# EAGLE design 3MB RAM Expansion (EAGLE 4.16)
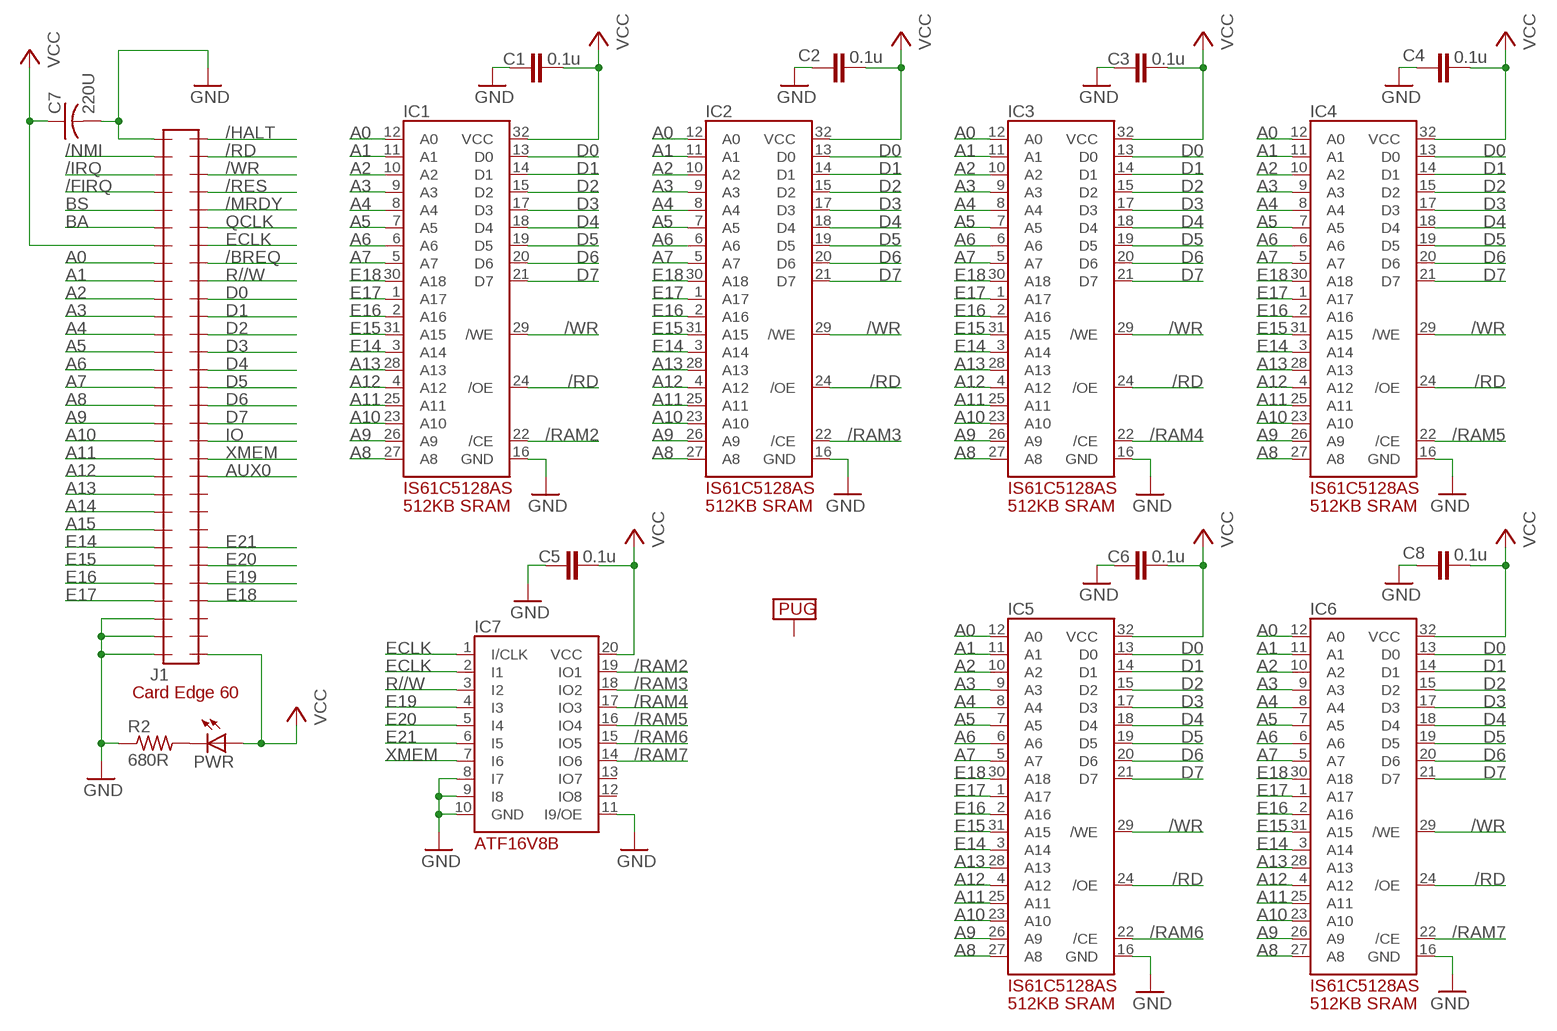
[diagram p0: schematic, sheet 1]

## Parts
C1  0.1u  C-EUC0603  [C0603]
C2  0.1u  C-EUC0603  [C0603]
C3  0.1u  C-EUC0603  [C0603]
C4  0.1u  C-EUC0603  [C0603]
C5  0.1u  C-EUC0603  [C0603]
C6  0.1u  C-EUC0603  [C0603]
C7  220U  C-US025-050X050  [C025-050X050]
C8  0.1u  C-EUC0603  [C0603]
IC1  IS61C5128AS  [SOIC32_11.3MM_WID]
IC2  IS61C5128AS  [SOIC32_11.3MM_WID]
IC3  IS61C5128AS  [SOIC32_11.3MM_WID]
IC4  IS61C5128AS  [SOIC32_11.3MM_WID]
IC5  IS61C5128AS  [SOIC32_11.3MM_WID]
IC6  IS61C5128AS  [SOIC32_11.3MM_WID]
IC7  PLD_ATF16V8B  [DIL20]
J1  CARDEDGE_2.54_60POS  CARDEDGE_2.54_60POSEDGE  [CARDEDGE_2.54_60POS]
PWR  LED3MM  [LED3MM]
R2  680R  R-US_R0603  [R0603]
U$1  PUG  [LARGE_PUG]

## Nets
/BREQ: J1.53
/FIRQ: J1.4
/HALT: J1.60
/IRQ: J1.3
/MRDY: J1.56
/NMI: J1.2
/RAM2: IC1.22(/CE) IC7.19(IO1)
/RAM3: IC2.22(/CE) IC7.18(IO2)
/RAM4: IC3.22(/CE) IC7.17(IO3)
/RAM5: IC4.22(/CE) IC7.16(IO4)
/RAM6: IC5.22(/CE) IC7.15(IO5)
/RAM7: IC6.22(/CE) IC7.14(IO6)
/RD: IC1.24(/OE) IC2.24(/OE) IC3.24(/OE) IC4.24(/OE) IC5.24(/OE) IC6.24(/OE) J1.59
/RES: J1.57
/WR: IC1.29(/WE) IC2.29(/WE) IC3.29(/WE) IC4.29(/WE) IC5.29(/WE) IC6.29(/WE) J1.58
A0: IC1.12(A0) IC2.12(A0) IC3.12(A0) IC4.12(A0) IC5.12(A0) IC6.12(A0) J1.8
A1: IC1.11(A1) IC2.11(A1) IC3.11(A1) IC4.11(A1) IC5.11(A1) IC6.11(A1) J1.9
A2: IC1.10(A2) IC2.10(A2) IC3.10(A2) IC4.10(A2) IC5.10(A2) IC6.10(A2) J1.10
A3: IC1.9(A3) IC2.9(A3) IC3.9(A3) IC4.9(A3) IC5.9(A3) IC6.9(A3) J1.11
A4: IC1.8(A4) IC2.8(A4) IC3.8(A4) IC4.8(A4) IC5.8(A4) IC6.8(A4) J1.12
A5: IC1.7(A5) IC2.7(A5) IC3.7(A5) IC4.7(A5) IC5.7(A5) IC6.7(A5) J1.13
A6: IC1.6(A6) IC2.6(A6) IC3.6(A6) IC4.6(A6) IC5.6(A6) IC6.6(A6) J1.14
A7: IC1.5(A7) IC2.5(A7) IC3.5(A7) IC4.5(A7) IC5.5(A7) IC6.5(A7) J1.15
A8: IC1.27(A8) IC2.27(A8) IC3.27(A8) IC4.27(A8) IC5.27(A8) IC6.27(A8) J1.16
A9: IC1.26(A9) IC2.26(A9) IC3.26(A9) IC4.26(A9) IC5.26(A9) IC6.26(A9) J1.17
A10: IC1.23(A10) IC2.23(A10) IC3.23(A10) IC4.23(A10) IC5.23(A10) IC6.23(A10) J1.18
A11: IC1.25(A11) IC2.25(A11) IC3.25(A11) IC4.25(A11) IC5.25(A11) IC6.25(A11) J1.19
A12: IC1.4(A12) IC2.4(A12) IC3.4(A12) IC4.4(A12) IC5.4(A12) IC6.4(A12) J1.20
A13: IC1.28(A13) IC2.28(A13) IC3.28(A13) IC4.28(A13) IC5.28(A13) IC6.28(A13) J1.21
A14: J1.22
A15: J1.23
AUX0: J1.41
BA: J1.6
BS: J1.5
D0: IC1.13(D0) IC2.13(D0) IC3.13(D0) IC4.13(D0) IC5.13(D0) IC6.13(D0) J1.51
D1: IC1.14(D1) IC2.14(D1) IC3.14(D1) IC4.14(D1) IC5.14(D1) IC6.14(D1) J1.50
D2: IC1.15(D2) IC2.15(D2) IC3.15(D2) IC4.15(D2) IC5.15(D2) IC6.15(D2) J1.49
D3: IC1.17(D3) IC2.17(D3) IC3.17(D3) IC4.17(D3) IC5.17(D3) IC6.17(D3) J1.48
D4: IC1.18(D4) IC2.18(D4) IC3.18(D4) IC4.18(D4) IC5.18(D4) IC6.18(D4) J1.47
D5: IC1.19(D5) IC2.19(D5) IC3.19(D5) IC4.19(D5) IC5.19(D5) IC6.19(D5) J1.46
D6: IC1.20(D6) IC2.20(D6) IC3.20(D6) IC4.20(D6) IC5.20(D6) IC6.20(D6) J1.45
D7: IC1.21(D7) IC2.21(D7) IC3.21(D7) IC4.21(D7) IC5.21(D7) IC6.21(D7) J1.44
E14: IC1.3(A14) IC2.3(A14) IC3.3(A14) IC4.3(A14) IC5.3(A14) IC6.3(A14) J1.24
E15: IC1.31(A15) IC2.31(A15) IC3.31(A15) IC4.31(A15) IC5.31(A15) IC6.31(A15) J1.25
E16: IC1.2(A16) IC2.2(A16) IC3.2(A16) IC4.2(A16) IC5.2(A16) IC6.2(A16) J1.26
E17: IC1.1(A17) IC2.1(A17) IC3.1(A17) IC4.1(A17) IC5.1(A17) IC6.1(A17) J1.27
E18: IC1.30(A18) IC2.30(A18) IC3.30(A18) IC4.30(A18) IC5.30(A18) IC6.30(A18) J1.34
E19: IC7.4(I3) J1.35
E20: IC7.5(I4) J1.36
E21: IC7.6(I5) J1.37
ECLK: IC7.1(I/CLK) IC7.2(I1) J1.54
GND [supply]: C1.1 C2.1 C3.1 C4.1 C5.1 C6.1 C7.2 C8.1 IC1.16(GND) IC2.16(GND) IC3.16(GND) IC4.16(GND) IC5.16(GND) IC6.16(GND) IC7.8(I7) IC7.9(I8) IC7.10(GND) IC7.11(I9/OE) J1.1 J1.28 J1.29 J1.30 R2.1
IO: J1.43
N$2: PWR.K(C) R2.2
QCLK: J1.55
R//W: IC7.3(I2) J1.52
VCC [supply]: C1.2 C2.2 C3.2 C4.2 C5.2 C6.2 C7.1 C8.2 IC1.32(VCC) IC2.32(VCC) IC3.32(VCC) IC4.32(VCC) IC5.32(VCC) IC6.32(VCC) IC7.20(VCC) J1.7 J1.31 PWR.A
XMEM: IC7.7(I6) J1.42
Unconnected: IC7.12(IO8) IC7.13(IO7) J1.32 J1.33 J1.38 J1.39 J1.40 U$1.P$1

## Notes on the sheet
- 512KB SRAM | 512KB SRAM | 512KB SRAM | 512KB SRAM
- 512KB SRAM | 512KB SRAM

## Library data of the parts
C1-C6 C8 = rcl:C-EU: CAPACITOR, European symbol
C7 = rcl:C-US: CAPACITOR, American symbol
IC1-IC6 = 07-Retrocomputing:IS61C5128AS
IC7 = 07-Retrocomputing:PLD_ATF16V8B
J1 = 07-Retrocomputing:CARDEDGE_2.54_60POS
PWR = led:LED: LED OSRAM: - CHIPLED LG R971, LG N971, LY N971, LG Q971, LY Q971, LO R971, LY R971 LH N974, LH R974 LS Q976, LO Q976, LY Q976 LO Q996 - Hyper CHIPLED LW Q18S LB Q993, LB Q99A, LB R99A - SideLED LS A670, LO A670, LY A670, LG A670, LP A670 LB A673, LV A673, LT A673, LW A673 LH A674 LY A675 LS A676, LA A676, LO A676, LY A676, LW A676 LS A679, LY A679, LG A679 - Hyper Micro SIDELED® LS Y876, LA Y876, LO Y876, LY Y876 LT Y87S - SmartLED LW L88C, LW L88S LB L89C, LB L89S, LG L890 LS L89K, LO L89K, LY L89K LS L896, LA L896, LO L896, LY L896 - TOPLED LS T670, LO T670, LY T670, LG T670, LP T670 LSG T670, LSP T670, LSY T670, LOP T670, LYG T670 LG T671, LOG T671, LSG T671 LB T673, LV T673, LT T673, LW T673 LH T674 LS T676, LA T676, LO T676, LY T676, LB T676, LH T676, LSB T676, LW T676 LB T67C, LV T67C, LT T67C, LS T67K, LO T67K, LY T67K, LW E67C LS E67B, LA E67B, LO E67B, LY E67B, LB E67C, LV E67C, LT E67C LW T67C LS T679, LY T679, LG T679 LS T770, LO T770, LY T770, LG T770, LP T770 LB T773, LV T773, LT T773, LW T773 LH T774 LS E675, LA E675, LY E675, LS T675 LS T776, LA T776, LO T776, LY T776, LB T776 LHGB T686 LT T68C, LB T68C - Hyper Mini TOPLED® LB M676 - Mini TOPLED Santana® LG M470 LS M47K, LO M47K, LY M47K Source: http://www.osram.convergy.de - LUMILED® LXK2-PW12-R00, LXK2-PW12-S00, LXK2-PW14-U00, LXK2-PW14-V00 LXK2-PM12-R00, LXK2-PM12-S00, LXK2-PM14-U00 LXK2-PE12-Q00, LXK2-PE12-R00, LXK2-PE12-S00, LXK2-PE14-T00, LXK2-PE14-U00 LXK2-PB12-K00, LXK2-PB12-L00, LXK2-PB12-M00, LXK2-PB14-N00, LXK2-PB14-P00, LXK2-PB14-Q00 LXK2-PR12-L00, LXK2-PR12-M00, LXK2-PR14-Q00, LXK2-PR14-R00 LXK2-PD12-Q00, LXK2-PD12-R00, LXK2-PD12-S00 LXK2-PH12-R00, LXK2-PH12-S00 LXK2-PL12-P00, LXK2-PL12-Q00, LXK2-PL12-R00 Source: www.luxeon.com
R2 = rcl:R-US_: RESISTOR, American symbol
U$1 = 07-Retrocomputing:PUG

## Net classes
0 default: width 0.203 mm, drill 0.203 mm, clearance 0.254 mm
1 supply: width 0.61 mm, drill 0.203 mm, clearance 0.305 mm

## Board
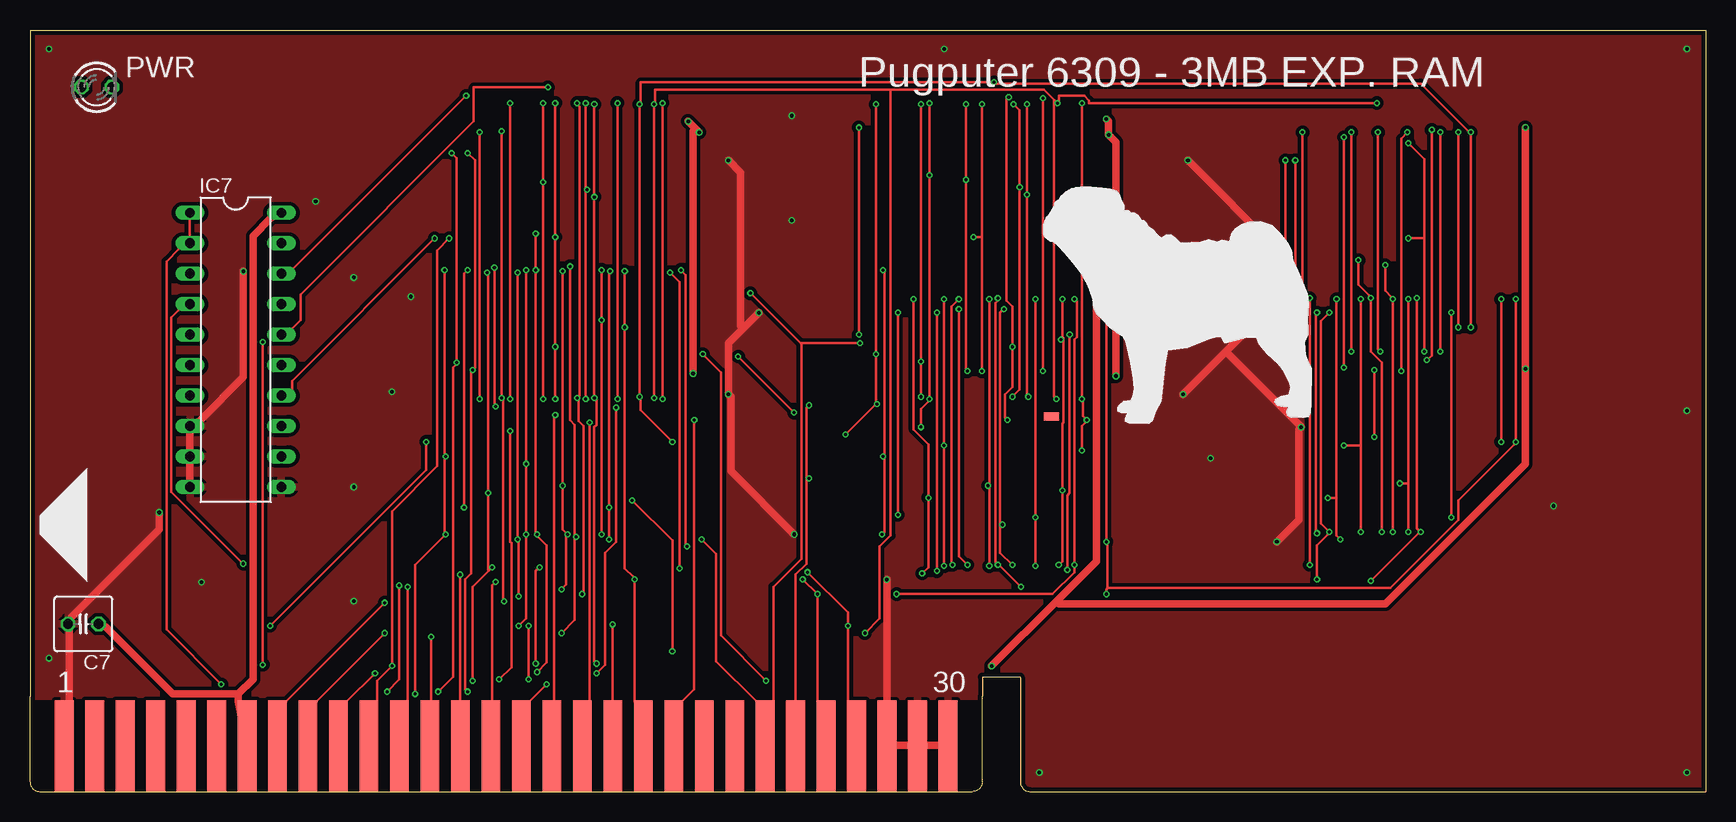
[diagram p1: board, top side]
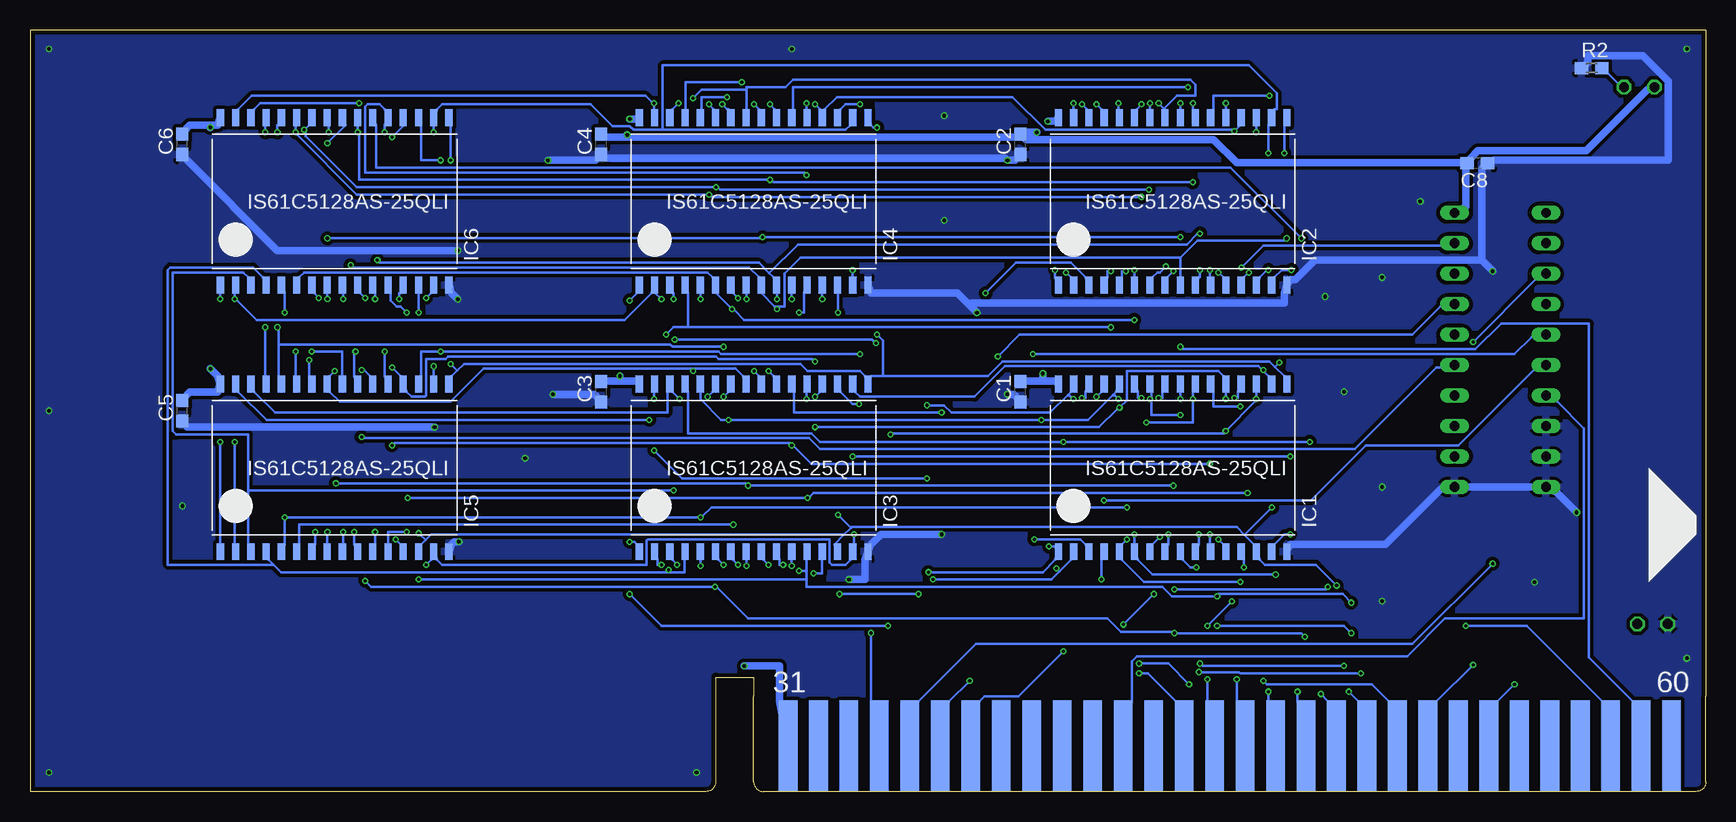
[diagram p2: board, bottom side, seen from below]

Size 139.7 x 63.5 mm. Coordinates in mm from the lower left corner, seen from the top.
Outline: 0,7.94 0,63.5 139.7,63.5 139.7,0 83.34,0 arc-90 82.55,0.79 82.55,9.53 79.38,9.53 79.38,7.94
Copper layers (1*16): Top 0.0356mm / dielectric 1.6mm / Bottom 0.0356mm
Design rules "oshpark-2layer": minimum track width 6mil, minimum drill 10mil, track to track 6mil, track to pad 6mil, pad to pad 6mil, via to via 6mil, smd to smd 6mil, copper to edge 15mil, drill to drill 6mil, minimum pad ring 5mil, minimum via ring 5mil, stop-mask expansion 2.5mil, vias tented up to drill 0mil, thermal gap 10mil

### Footprints (pad centres in the part's own frame; a part is rotated, then mirrored left to right if it is on the bottom)
C0603 = smd 1.1 x 1: 1 -0.85,0; 2 0.85,0
C025-050X050 = drill 0.813 octagon: 1 -1.27,0; 2 1.27,0
SOIC32_11.3MM_WID = smd 1.4 x 0.6: 1 -6.985,9.525; 2 -6.985,8.255; 3 -6.985,6.985; 4 -6.985,5.715; 5 -6.985,4.445; 6 -6.985,3.175; 7 -6.985,1.905; 8 -6.985,0.635; 9 -6.985,-0.635; 10 -6.985,-1.905; 11 -6.985,-3.175; 12 -6.985,-4.445; 13 -6.985,-5.715; 14 -6.985,-6.985; 15 -6.985,-8.255; 16 -6.985,-9.525; 17 6.985,-9.525; 18 6.985,-8.255; 19 6.985,-6.985; 20 6.985,-5.715; 21 6.985,-4.445; 22 6.985,-3.175; 23 6.985,-1.905; 24 6.985,-0.635; 25 6.985,0.635; 26 6.985,1.905; 27 6.985,3.175; 28 6.985,4.445; 29 6.985,5.715; 30 6.985,6.985; 31 6.985,8.255; 32 6.985,9.525
DIL20 = drill 0.813 long: 1 -11.43,-3.81; 2 -8.89,-3.81; 3 -6.35,-3.81; 4 -3.81,-3.81; 5 -1.27,-3.81; 6 1.27,-3.81; 7 3.81,-3.81; 8 6.35,-3.81; 9 8.89,-3.81; 10 11.43,-3.81; 11 11.43,3.81; 12 8.89,3.81; 13 6.35,3.81; 14 3.81,3.81; 15 1.27,3.81; 16 -1.27,3.81; 17 -3.81,3.81; 18 -6.35,3.81; 19 -8.89,3.81; 20 -11.43,3.81
CARDEDGE_2.54_60POS = smd 1.556 x 7.62: 1 -36.83,3.81; 2 -34.29,3.81; 3 -31.75,3.81; 4 -29.21,3.81; 5 -26.67,3.81; 6 -24.13,3.81; 7 -21.59,3.81; 8 -19.05,3.81; 9 -16.51,3.81; 10 -13.97,3.81; 11 -11.43,3.81; 12 -8.89,3.81; 13 -6.35,3.81; 14 -3.81,3.81; 15 -1.27,3.81; 16 1.27,3.81; 17 3.81,3.81; 18 6.35,3.81; 19 8.89,3.81; 20 11.43,3.81; 21 13.97,3.81; 22 16.51,3.81; 23 19.05,3.81; 24 21.59,3.81; 25 24.13,3.81; 26 26.67,3.81; 27 29.21,3.81; 28 31.75,3.81; 29 34.29,3.81; 30 36.83,3.81 | smd 1.556 x 7.62 bottom: 31 36.83,3.81; 32 34.29,3.81; 33 31.75,3.81; 34 29.21,3.81; 35 26.67,3.81; 36 24.13,3.81; 37 21.59,3.81; 38 19.05,3.81; 39 16.51,3.81; 40 13.97,3.81; 41 11.43,3.81; 42 8.89,3.81; 43 6.35,3.81; 44 3.81,3.81; 45 1.27,3.81; 46 -1.27,3.81; 47 -3.81,3.81; 48 -6.35,3.81; 49 -8.89,3.81; 50 -11.43,3.81; 51 -13.97,3.81; 52 -16.51,3.81; 53 -19.05,3.81; 54 -21.59,3.81; 55 -24.13,3.81; 56 -26.67,3.81; 57 -29.21,3.81; 58 -31.75,3.81; 59 -34.29,3.81; 60 -36.83,3.81
LED3MM = drill 0.813 octagon: A -1.27,0; K 1.27,0
R0603 = smd 1.1 x 1: 1 -0.85,0; 2 0.85,0
LARGE_PUG = smd 1.27 x 0.635: P$1 2.286,3.962

### Placement (x,y rotation side)
C1  57.15,33.34 90 bottom
C2  57.15,53.98 90 bottom
C3  92.08,33.34 90 bottom
C4  92.08,53.98 90 bottom
C5  127,31.75 90 bottom
C6  127,53.98 90 bottom
C7  4.45,13.97 180 top
C8  19.05,52.39 180 bottom
IC1  44.45,26.99 90 bottom
IC2  44.45,49.21 90 bottom
IC3  79.38,26.99 90 bottom
IC4  79.38,49.21 90 bottom
IC5  114.3,26.99 90 bottom
IC6  114.3,49.21 90 bottom
IC7  17.14,36.83 270 top
J1  39.69,0 0 top
PWR  5.56,58.74 0 top
R2  9.53,60.33 0 bottom
U$1  82.87,27.3 0 top

### Tracks (layer width: path | path; a pad name or v marks a point on that pad's centre or on a via)
/RAM2  (via drill 0.25)
  Top 0.203: v38.81,32.11 38.71,32.21 v38.71,43.69
  Bottom 0.203: v38.81,32.11 41.05,32.11 41.05,33.33 IC1.22 | v38.71,43.69 36.88,45.52 22.15,45.52 IC7.19
/RAM3  (via drill 0.25)
  Top 0.203: v36.37,58.01 21.95,43.59 IC7.18
  Bottom 0.203: v36.37,58.01 41.05,58.01 41.05,56.9 IC2.22
/RAM4  (via drill 0.25)
  Top 0.203: v59.03,36.27 v63.7,31.6
  Bottom 0.203: v63.7,31.6 76,31.6 76,33.33 IC3.22 | v59.03,36.27 57.2,38.1 24.49,38.1 22.15,40.44 IC7.17
/RAM5  (via drill 0.25)
  Top 0.203: v43.18,58.73 36.98,58.73 36.98,55.88 22.55,41.45 22.55,39.32 21.84,38.61 IC7.16
  Bottom 0.203: v43.18,58.73 76.1,58.73 76.1,56.9 IC4.22
/RAM6  (via drill 0.25)
  Top 0.203: v112.06,29.57 v112.06,35.15
  Bottom 0.203: v112.06,35.15 111.86,35.15 111.35,34.65 IC5.22 | v112.06,29.57 111.96,29.46 74.78,29.46 73.86,28.55 29.26,28.55 22.45,35.36 22.15,35.36 IC7.15
/RAM7  (via drill 0.25)
  Top 0.203: v33.73,46.13 21.84,34.24 21.84,33.53 IC7.14
  Bottom 0.203: v33.73,46.13 39.62,52.02 110.85,52.02 110.85,55.58 IC6.22
/RD  (via drill 0.25)
  Top 0.203: 116.23,46.13 116.23,52.73 v114.91,54.05 | 116.23,46.13 v116.23,36.68 | 79.35,46.23 v79.35,57.3 | 79.35,46.23 v79.35,35.05 | v43.79,57.4 v43.79,46.23 v43.79,37.08 v43.79,32.72 | v78.64,46.23 79.35,46.23 | v114.91,46.13 116.23,46.13
  Bottom 0.203: v116.23,36.68 113.69,36.68 113.69,34.65 IC5.24 | v114.91,54.05 113.39,55.58 IC6.24 | v79.35,35.05 78.94,34.65 IC3.24 | v79.35,57.3 78.94,56.9 IC4.24 | v43.79,32.72 43.79,33.33 IC1.24 | v43.79,57.4 43.79,56.9 IC2.24 | v43.79,37.08 43.59,36.88 19.2,36.88 17.07,39.01 9.75,39.01 9.75,11.18 6.1,7.52 J1.59 | v43.79,46.23 v78.64,46.23 78.84,46.13 v114.91,46.13
/WR  (via drill 0.25)
  Top 0.203: v120.09,38.71 v120.09,54.97 119.89,55.07 115.93,59.03 80.57,59.03 v80.37,59.13 50.9,59.13 50.9,57.51 v50.8,57.3 v50.8,32.92 50.9,32.72 50.9,31.8 v53.54,29.16 | v20.02,13.82 33.02,26.82 v33.02,29.16
  Bottom 0.203: v120.09,38.71 120.09,34.65 IC5.29 | v120.09,54.97 120.09,55.58 IC6.29 | v50.8,32.92 50.39,33.33 IC1.29 | v50.8,57.3 50.39,56.9 IC2.29 | IC3.29 84.84,33.33 84.84,29.87 74.57,29.87 73.86,29.16 v53.54,29.16 v33.02,29.16 | v80.37,59.13 85.04,59.13 85.04,56.9 IC4.29 | v20.02,13.82 14.94,13.82 8.64,7.52 J1.58
A0  (via drill 0.25)
  Top 0.203: v108.31,39.93 107.59,39.22 107.59,22.35 v108.31,21.64 108.2,21.44 107.29,20.52 v107.29,17.68 | v40.64,43.28 v40.64,21.03 40.74,20.83 v40.74,16.26 | v75.59,18.39 v75.59,39.93 | v29.57,15.75 21.34,7.52 J1.8
  Bottom 0.203: v108.31,21.64 109.83,21.64 109.83,20.62 IC5.12 | v108.31,39.93 108.81,40.44 109.12,40.44 109.63,40.95 109.63,41.55 IC6.12 | v40.64,21.03 40.23,20.62 IC1.12 | v40.64,43.28 40.23,42.88 IC2.12 | 74.98,17.68 74.98,17.07 45.31,17.07 44.5,16.26 v40.74,16.26 40.64,16.46 30.28,16.46 v29.57,15.75 | 74.98,17.68 74.98,18.39 | 74.98,18.39 74.98,19.3 IC3.12 | v75.59,39.93 75.18,39.93 75.18,41.55 IC4.12 | 74.98,18.39 v75.59,18.39 | 74.98,17.68 v107.29,17.68
A1  (via drill 0.25)
  Top 0.203: 110.95,28.85 v110.95,41.05 | 110.95,28.85 v110.95,21.64 | v76.2,41.05 v76.2,28.85 v76.2,18.8 | v109.53,28.85 110.95,28.85 | v41.35,43.48 v41.35,27.33 v41.35,21.44 41.35,14.43 v40.74,13.82 | v29.57,13.21 23.88,7.52 J1.9
  Bottom 0.203: v110.95,21.64 110.95,20.62 IC5.11 | v110.95,41.05 110.95,41.55 IC6.11 | v76.2,18.8 IC3.11 | v76.2,41.05 IC4.11 | v109.53,28.85 109.32,29.06 76.4,29.06 v76.2,28.85 76,28.75 74.57,27.33 v41.35,27.33 | v41.35,21.44 41.35,20.62 IC1.11 | v41.35,43.48 41.35,42.88 IC2.11 | v29.57,13.21 30.18,13.82 v40.74,13.82
A2  (via drill 0.25)
  Top 0.203: v112.67,21.64 112.67,35.76 111.76,36.68 v111.76,41.15 111.66,41.35 110.74,42.27 v110.74,44.3 | v76.91,18.9 76.81,19 76.81,40.44 v77.42,41.05 | v28.75,9.86 26.42,7.52 J1.10 | v42.27,9.96 43.08,10.77 43.08,20.52 42.37,21.23 v42.27,21.44 42.16,21.54 v42.16,43.48 v42.16,46.53
  Bottom 0.203: v112.67,21.64 112.67,20.62 IC5.10 | v111.76,41.15 112.17,41.55 IC6.10 | v76.91,18.9 77.22,18.9 77.22,19.3 IC3.10 | v77.42,41.05 77.42,41.55 IC4.10 77.72,42.88 78.08,43.23 | v110.74,44.3 110.54,44.09 78.94,44.09 78.08,43.23 | v42.27,21.44 42.27,20.62 IC1.10 | v42.16,43.48 42.16,42.88 42.27,42.88 IC2.10 | v28.75,9.86 38.81,9.86 38.91,9.96 v42.27,9.96 | v42.16,46.53 42.37,46.53 43.28,45.62 75.69,45.62 78.08,43.23
A3  (via drill 0.25)
  Top 0.203: v42.47,18.69 42.16,18.39 v42.16,10.67 | J1.11 28.96,7.52 28.96,9.25 v30.18,10.46 30.18,23.37 33.93,27.13 33.93,45.11 v34.95,46.13 | v113.59,21.64 v113.59,41.05 113.49,41.25 112.98,41.76 v112.98,43.89 | v78.13,18.9 77.42,19.61 v77.42,40.23
  Bottom 0.203: v42.47,18.69 42.98,18.69 43.59,19.3 IC1.9 | v42.16,10.67 41.96,10.46 v30.18,10.46 | v113.59,21.64 113.59,20.62 IC5.9 | v113.59,41.05 113.59,41.55 IC6.9 | 43.79,44.5 43.79,42.88 IC2.9 | 43.79,44.5 75.49,44.5 76.81,43.18 76.81,40.44 77.42,40.44 | 77.42,40.44 77.62,40.44 78.74,41.55 IC4.9 78.94,42.88 79.76,43.69 112.78,43.69 v112.98,43.89 | v78.13,18.9 78.54,19.3 IC3.9 | 77.42,40.44 v77.42,40.23 | v34.95,46.13 35.15,45.92 42.37,45.92 43.79,44.5
A4  (via drill 0.25)
  Top 0.203: 114.91,25.7 v114.91,41.05 | 114.91,25.7 v114.91,21.64 | 79.96,25.5 v79.96,41.05 | 79.96,25.5 v79.96,18.8 | v114.2,25.7 114.91,25.7 | v79.86,25.5 79.96,25.5 | v44.4,43.38 v44.4,25.5 44.4,21.84 v44.81,21.44 44.7,21.23 44.7,17.27 v44.3,16.87 | v31.5,17.07 31.5,7.52 J1.12
  Bottom 0.203: v114.91,21.64 114.91,20.62 IC5.8 | v114.91,41.05 114.91,41.55 IC6.8 | v79.96,18.8 79.96,19.3 IC3.8 | v79.96,41.05 79.96,41.55 IC4.8 | v114.2,25.7 80.06,25.7 v79.86,25.5 v44.4,25.5 | v44.81,21.44 44.81,20.62 IC1.8 | v44.4,43.38 44.91,42.88 IC2.8 | v31.5,17.07 31.7,16.87 v44.3,16.87
A5  (via drill 0.25)
  Top 0.203: v115.62,41.15 115.62,21.95 v115.93,21.64 115.72,21.54 v111.76,17.58 | v80.67,41.15 80.67,40.95 80.47,40.74 80.47,19.1 v80.67,18.9 80.87,18.8 v82.6,17.07 | v45.01,43.79 45.01,30.99 45.41,30.58 45.41,21.34 v45.52,21.23 45.41,21.03 45.41,14.33 v44.3,13.21 | v33.43,12.9 33.43,7.52 J1.13
  Bottom 0.203: v115.93,21.64 115.93,20.62 IC5.7 | v115.62,41.15 116.03,41.55 IC6.7 | v80.67,18.9 81.08,19.3 IC3.7 | v80.67,41.15 81.08,41.55 IC4.7 | v111.76,17.58 111.25,17.07 v82.6,17.07 82.4,16.97 79.86,14.43 49.89,14.43 48.77,13.31 44.5,13.31 v44.3,13.21 33.73,13.21 v33.43,12.9 | v45.52,21.23 46.13,20.62 IC1.7 | v45.01,43.79 45.52,43.28 45.72,43.28 46.13,42.88 IC2.7
A6  (via drill 0.25)
  Top 0.203: v81.89,18.9 80.87,19.91 80.87,22.25 | 80.87,22.25 80.87,39.93 v81.18,40.23 | 80.87,22.25 v81.08,22.25 | v35.87,18.09 35.87,7.52 J1.14 | v47.65,21.44 v47.65,39.32 v47.65,43.48
  Bottom 0.203: v81.89,18.9 82.3,19.3 IC3.6 | v81.08,22.25 117.25,22.25 117.25,20.62 IC5.6 | IC6.6 117.25,42.88 116.84,43.28 83.21,43.28 82.8,42.88 IC4.6 82.5,41.55 v81.18,40.23 80.97,40.13 80.16,39.32 v47.65,39.32 | v35.87,18.09 46.13,18.09 47.35,19.3 IC1.6 47.65,20.62 v47.65,21.44 | v47.65,43.48 47.65,42.88 IC2.6
A7  (via drill 0.25)
  Top 0.203: v83.82,41.05 v83.82,22.86 v83.82,18.8 | v118.47,22.86 v118.47,39.93 | v38.81,17.48 38.51,17.17 38.51,7.52 J1.15 | v48.36,43.38 48.26,43.28 v48.26,23.67 v48.26,21.03
  Bottom 0.203: v83.82,18.8 IC3.5 | v83.82,41.05 IC4.5 | IC5.5 118.47,20.62 v118.47,22.86 v83.82,22.86 83.62,22.96 82.91,23.67 v48.26,23.67 | v118.47,39.93 118.47,41.55 IC6.5 | v38.81,17.48 46.84,17.48 48.67,19.3 IC1.5 48.67,20.62 v48.26,21.03 | v48.36,43.38 48.67,43.38 48.67,42.88 IC2.5
A8  (via drill 0.25)
  Top 0.203: v117.55,54.97 v117.55,36.68 | v83.21,32.92 83.11,33.02 v83.11,49.78 v83.11,57.3 | v47.04,57.3 v47.04,49.58 v47.04,32.82 47.24,32.72 47.24,30.58 47.04,30.38 47.04,10.87 v47.24,10.67 | v43.08,8.94 41.66,7.52 J1.16
  Bottom 0.203: v117.55,36.68 117.55,34.65 IC5.27 | IC6.27 117.55,55.58 v117.55,54.97 117.45,54.76 112.47,49.78 v83.11,49.78 82.91,49.68 82.8,49.58 v47.04,49.58 | v83.21,32.92 82.8,33.33 IC3.27 | v83.11,57.3 82.7,56.9 IC4.27 | v47.04,32.82 47.35,32.82 47.35,33.33 IC1.27 | v47.04,57.3 47.45,56.9 IC2.27 | v43.08,8.94 44.81,10.67 v47.24,10.67
A9  (via drill 0.25)
  Top 0.203: v116.43,35.97 116.84,36.37 v116.84,55.17 | v81.89,32.92 82.5,33.53 v82.5,50.39 82.5,56.79 v81.99,57.3 | v43.79,31.39 43.69,31.29 43.69,7.52 J1.17 | v46.33,32.72 46.33,50.19 | 46.33,50.19 v46.33,57.4 | 46.33,50.19 v46.43,50.19
  Bottom 0.203: v116.43,35.97 116.43,34.65 IC5.26 | IC6.26 116.43,55.58 v116.84,55.17 116.74,54.97 116.74,54.66 112.47,50.39 v82.5,50.39 82.3,50.29 82.19,50.19 v46.43,50.19 | v81.89,32.92 81.48,33.33 IC3.26 | v81.99,57.3 81.58,56.9 81.48,56.9 IC4.26 | 46.23,32.72 46.23,31.39 v43.79,31.39 | 46.23,32.72 46.23,33.33 IC1.26 | v46.33,57.4 46.33,56.9 IC2.26 | 46.23,32.72 v46.33,32.72
A10  (via drill 0.25)
  Top 0.203: v112.57,36.68 112.37,36.88 v112.37,54.97 | v78.13,35.05 78.03,35.15 v78.03,51 v78.03,57.3 | v46.63,30.79 46.63,7.52 J1.18 | v42.77,32.72 v42.77,50.8 v42.77,57.4
  Bottom 0.203: v112.57,36.68 112.67,36.68 112.67,34.65 IC5.23 | IC6.23 112.37,55.58 v112.37,54.97 112.27,54.76 112.27,51 v78.03,51 77.83,50.9 77.72,50.8 v42.77,50.8 | v78.13,35.05 77.72,34.65 IC3.23 | v78.03,57.3 77.62,56.9 IC4.23 | v46.63,30.79 42.77,30.79 v42.77,32.72 42.77,33.33 IC1.23 | v42.77,57.4 42.77,56.9 IC2.23
A11  (via drill 0.25)
  Top 0.203: v114.81,54.97 114.3,54.46 v114.3,35.05 | v45.62,57.4 45.62,57.3 45.82,57.1 45.82,33.02 v45.62,32.82 45.72,32.61 45.72,30.89 46.13,30.48 46.13,16.56 v46.02,16.46 | v48.56,13.92 48.56,7.52 J1.19 | v84.43,57.81 v84.43,35.05
  Bottom 0.203: 84.43,35.26 101.91,35.26 104.65,32.51 113.89,32.51 114.71,33.33 IC5.25 114.71,34.65 v114.3,35.05 | 84.43,35.26 80.87,35.26 80.26,34.65 IC3.25 | v114.81,54.97 114.81,55.58 IC6.25 | v45.62,32.82 45.31,32.82 45.31,33.33 IC1.25 | 45.16,56.95 45.11,56.9 IC2.25 | v45.62,57.4 45.16,56.95 | 79.96,58.52 79.96,58.73 76.71,58.73 76.1,59.33 42.98,59.33 42.57,58.93 42.57,58.01 44.09,58.01 45.16,56.95 | 79.96,58.52 79.96,56.9 IC4.25 | v48.56,13.92 v46.02,16.46 | v84.43,35.05 84.43,35.26 | v84.43,57.81 83.72,58.52 79.96,58.52
A12  (via drill 0.25)
  Top 0.203: J1.20 50.39,7.52 v50.39,17.68 50.29,17.88 49.58,18.59 v49.58,38.71 v49.58,43.38 | v86.46,18.49 86.46,24.69 86.67,24.89 v86.67,38.1
  Bottom 0.203: 86.46,18.29 118.77,18.29 119.43,18.95 | 86.46,18.29 85.14,18.29 85.14,19.3 IC3.4 | 119.43,18.95 119.79,19.3 IC5.4 | IC6.4 120.29,42.88 121.11,43.69 128.02,43.69 128.22,43.48 128.22,18.9 119.48,18.9 119.43,18.95 | v50.39,17.68 50.39,19.3 IC1.4 | v49.58,43.38 49.89,43.38 49.89,42.88 IC2.4 | 84.84,38.71 84.84,41.55 IC4.4 | v49.58,38.71 84.84,38.71 | v86.46,18.49 86.46,18.29 | v86.67,38.1 86.06,38.71 84.84,38.71
A13  (via drill 0.25)
  Top 0.203: v119.08,38.71 v119.08,54.97 | v48.97,32.72 v48.97,57.4 | v81.58,57.91 81.38,57.71 81.38,40.95 81.89,40.44 v81.89,37.08 81.89,33.73 81.28,33.12 81.28,31.19 v81.48,30.99 | v55.37,30.99 55.37,8.53 54.36,7.52 J1.21
  Bottom 0.203: 118.97,37.29 118.97,38.71 v119.08,38.71 | 118.97,37.29 118.97,34.65 IC5.28 | v119.08,54.97 119.08,55.58 118.97,55.58 IC6.28 | 49.43,33.07 51.51,30.99 v55.37,30.99 v81.48,30.99 82.09,30.99 83.82,32.72 IC3.28 | 49.43,33.07 49.17,33.33 IC1.28 | v48.97,57.4 48.97,56.9 IC2.28 | v48.97,32.72 49.28,33.02 49.38,33.02 49.43,33.07 | v81.58,57.91 83.72,57.91 83.72,56.9 IC4.28 | 118.97,37.29 86.36,37.29 86.16,37.08 v81.89,37.08
D0  (via drill 0.25)
  Top 0.203: v109.22,21.03 108.92,21.34 108.92,24.49 | 108.92,24.49 v108.92,41.05 | v74.37,18.19 74.88,18.69 v74.88,24.49 74.88,28.96 73.66,30.18 v73.66,41.05 | v108.2,24.49 108.92,24.49 | 38.25,18.44 36.88,17.07 v36.88,9.25 | 38.25,18.44 v38.51,18.69 | v38.1,43.28 38.2,43.18 v38.2,24.89 38.2,18.49 38.25,18.44
  Bottom 0.203: v109.22,21.03 108.81,20.62 IC5.13 | v108.92,41.05 108.92,41.55 108.81,41.55 IC6.13 | v74.37,18.19 73.66,18.19 IC3.13 | v73.66,41.05 IC4.13 | v108.2,24.49 v74.88,24.49 74.68,24.59 74.37,24.89 v38.2,24.89 | v38.51,18.69 38.51,19.3 IC1.13 | v36.88,9.25 36.58,8.94 27.84,8.94 26.42,7.52 J1.51 | v38.1,43.28 38.51,42.88 IC2.13
D1  (via drill 0.25)
  Top 0.203: v36.47,43.48 36.17,43.18 v36.17,23.67 | v72.34,23.06 v72.34,39.93 | v107.29,39.93 107.19,39.83 107.19,21.64 v107.29,21.54 | v29.77,8.33 30.79,9.35 v30.79,17.17
  Bottom 0.203: 38.46,21.39 39.12,22.05 71.22,22.05 71.27,22 | 38.46,21.39 37.69,20.62 IC1.14 37.19,19.3 36.78,18.9 32.51,18.9 v30.79,17.17 | 71.88,21.39 72.64,20.62 IC3.14 | 71.27,22 71.88,21.39 | v36.47,43.48 36.58,43.48 37.19,42.88 IC2.14 | 38.46,21.39 v36.17,23.67 | 106.73,20.98 106.27,21.44 71.93,21.44 71.88,21.39 | 106.73,20.98 107.09,20.62 IC5.14 | v72.34,39.93 72.34,41.55 IC4.14 | 71.27,22 v72.34,23.06 | v107.29,39.93 107.29,41.55 IC6.14 | 106.73,20.98 v107.29,21.54 | v29.77,8.33 28.96,7.52 J1.50
D2  (via drill 0.25)
  Top 0.203: v32.11,8.13 32.11,18.9 v34.65,21.44 34.54,21.64 34.54,27.94 | 34.54,27.94 v34.54,43.48 | v71.12,43.48 71.22,43.38 71.22,27.94 | 71.22,27.94 71.22,21.64 v71.02,21.44 | v106.68,18.9 v106.68,41.15 | 34.54,27.94 v34.65,27.94 | v71.12,27.94 71.22,27.94
  Bottom 0.203: v34.65,21.44 35.15,21.44 35.97,20.62 IC1.15 | v32.11,8.13 31.5,7.52 J1.49 | v34.54,43.48 35.36,43.48 35.97,42.88 IC2.15 | v71.02,21.44 71.02,20.62 IC3.15 71.32,19.3 71.73,18.9 72.85,18.9 73.05,19.1 73.05,21.03 88.19,21.03 88.29,20.93 88.29,18.9 105.36,18.9 105.77,19.3 IC5.15 106.27,19.3 v106.68,18.9 | v71.12,43.48 IC4.15 | v106.68,41.15 106.27,41.55 IC6.15 | v34.65,27.94 v71.12,27.94
D3  (via drill 0.25)
  Top 0.203: v35.15,53.24 35.56,52.83 v35.56,35.76 35.46,35.56 35.26,35.36 35.26,9.55 v34.04,8.33 | v69.09,38.1 v69.09,55.37 | v104.65,35.66 v104.65,52.63
  Bottom 0.203: 35.92,35.41 36.37,35.87 58.62,35.87 59.84,34.65 68.58,34.65 | 35.92,35.41 35.15,34.65 IC1.17 | 68.58,34.65 69.6,34.65 IC3.17 70.1,34.65 70.51,35.05 74.88,35.05 75.49,35.66 103.53,35.66 104.09,35.1 | 104.09,35.1 104.55,34.65 IC5.17 | v35.15,53.24 35.15,55.58 IC2.17 | v35.56,35.76 35.92,35.41 | v69.09,55.37 69.39,55.37 69.6,55.58 IC4.17 | v69.09,38.1 68.58,37.59 68.58,34.65 | v104.65,52.63 104.65,55.58 IC6.17 | 104.09,35.1 v104.65,35.66 | v34.04,8.33 34.04,7.52 J1.48
D4  (via drill 0.25)
  Top 0.203: v106.07,54.97 v106.07,35.46 | v36.47,53.24 37.08,52.63 37.08,35.36 v36.88,35.15 36.78,34.95 36.78,18.19 36.27,17.68 36.27,8.53 v36.47,8.33
  Bottom 0.203: 86.97,55.17 89.41,55.17 89.71,55.47 91.14,55.47 92.96,57.3 105.36,57.3 105.77,56.9 IC6.18 106.07,55.58 v106.07,54.97 | 86.97,55.17 71.73,55.17 71.32,55.58 IC4.18 | v106.07,35.46 106.07,34.65 IC5.18 | 36.93,35.1 37.29,35.46 58.42,35.46 60.96,32.92 70.51,32.92 70.92,33.33 IC3.18 | 36.93,35.1 36.47,34.65 IC1.18 | v36.47,53.24 36.47,55.58 IC2.18 35.97,56.9 35.76,56.9 35.76,58.22 38.1,60.55 86.97,60.55 86.97,55.17 | v36.88,35.15 36.93,35.1 | v36.47,8.33 36.47,7.52 J1.47
D5  (via drill 0.25)
  Top 0.203: v70.51,57.3 v70.51,36.47 70.51,32.41 v70.61,32.31 70.41,32.21 v67.97,29.77 | v105.46,36.68 v105.46,52.63 | v37.49,32.72 v37.49,54.97 | v39.12,9.35 40.13,10.36 40.13,20.73 40.03,20.83 v40.03,30.07
  Bottom 0.203: v70.61,32.31 71.12,32.31 72.14,33.33 IC3.19 | v70.51,57.3 71.73,57.3 72.14,56.9 IC4.19 | v70.51,36.47 82.09,36.47 82.3,36.68 v105.46,36.68 107.09,36.68 107.09,34.65 IC5.19 | v105.46,52.63 107.09,52.63 107.09,55.58 IC6.19 | v37.49,54.97 37.49,55.58 IC2.19 | IC1.19 37.49,33.33 v37.49,32.72 37.59,32.51 v40.03,30.07 40.13,29.87 67.87,29.87 v67.97,29.77 | v39.12,9.35 39.12,7.52 J1.46
D6  (via drill 0.25)
  Top 0.203: v109.53,35.36 v109.53,54.56 | v74.27,57.3 v74.27,35.87 v74.27,32.92 | v39.32,55.07 v39.32,32.82 39.42,32.61 39.42,15.95 v39.52,15.85 | v41.55,9.35 v41.55,13.82
  Bottom 0.203: v109.53,35.36 108.81,34.65 IC5.20 108.31,33.33 107.9,32.92 106.78,32.92 106.68,33.02 106.68,36.07 105.05,36.07 104.85,36.27 82.5,36.27 82.3,36.07 74.47,36.07 v74.27,35.87 | v109.53,54.56 108.51,55.58 IC6.20 | v74.27,32.92 73.86,33.33 IC3.20 | v74.27,57.3 73.86,56.9 IC4.20 73.46,56.9 72.44,57.91 57.81,57.91 55.07,55.17 39.52,55.17 v39.32,55.07 38.81,55.58 IC2.20 | v39.32,32.82 39.01,32.82 39.01,33.33 IC1.20 | v41.55,9.35 41.55,7.52 J1.45 | v41.55,13.82 v39.52,15.85
D7  (via drill 0.25)
  Top 0.203: v110.13,54.97 v110.13,36.68 | v74.98,57.4 v74.98,51.41 v74.98,32.72 74.88,32.51 74.27,31.9 v74.27,30.38 | v40.03,32.72 v40.03,57.4 | v47.24,9.86 47.95,10.57 47.95,19.91 48.87,20.83 v48.87,32
  Bottom 0.203: v110.13,36.68 110.13,34.65 IC5.21 | v110.13,54.97 110.13,55.58 IC6.21 110.13,56.9 110.54,57.3 111.56,57.3 111.76,57.1 111.76,51.61 75.18,51.61 v74.98,51.41 | v74.98,32.72 74.98,33.33 IC3.21 | v74.98,57.4 74.98,56.9 IC4.21 | v40.03,32.72 40.03,33.33 IC1.21 40.23,34.65 40.64,35.05 48.26,35.05 48.26,32.61 v48.87,32 49.07,31.9 50.6,30.38 v74.27,30.38 | v40.03,57.4 40.03,56.9 IC2.21 | v47.24,9.86 46.53,9.86 44.2,7.52 J1.44
E14  (via drill 0.25)
  Top 0.203: v55.98,21.03 57.2,19.81 57.2,10.87 60.55,7.52 J1.24 61.98,7.52 61.98,17.07 64.31,19.41 64.31,37.29 64.26,37.34 | 64.26,37.34 v60.05,41.55 | v85.75,18.9 86.06,19.2 v86.06,25.09 86.06,30.68 86.16,30.79 86.16,37.8 86.11,37.85 | 86.11,37.85 86.06,37.9 v86.06,41.05 | v69.19,37.39 64.31,37.39 64.26,37.34 | v85.95,37.69 86.11,37.85
  Bottom 0.203: v55.98,21.03 52.12,21.03 51.71,20.62 IC1.3 | v60.05,41.55 57.51,44.09 52.93,44.09 51.71,42.88 IC2.3 | v85.75,18.9 86.16,19.3 IC3.3 | v86.06,41.05 86.06,41.55 86.16,41.55 IC4.3 | 121.51,25.09 121.51,29.77 127.51,29.77 127.81,30.07 127.81,43.28 121.92,43.28 121.51,42.88 IC6.3 | 121.51,25.09 121.51,20.62 IC5.3 | v86.06,25.09 121.51,25.09 | v69.19,37.39 69.49,37.69 v85.95,37.69
E15  (via drill 0.25)
  Top 0.203: v87.68,57.4 v87.68,32.72 87.78,32.51 87.78,31.29 v88.09,30.99 87.99,30.79 87.68,30.48 v87.68,28.45 | v64.92,32.21 64.72,32 64.72,26.11 | 64.72,26.11 64.72,19 63.8,18.09 63.8,7.52 J1.25 | v52.73,32.72 v52.73,57.4 | 64.72,26.11 v64.92,26.11
  Bottom 0.203: v87.68,32.72 87.68,33.33 IC3.31 | IC4.31 87.68,56.9 v87.68,57.4 87.88,57.51 88.39,58.01 121.21,58.01 122.33,56.9 IC6.31 | v88.09,30.99 119.99,30.99 122.33,33.33 IC5.31 | 53.19,33.07 54.66,31.6 62.89,31.6 63.5,32.21 v64.92,32.21 | 53.19,33.07 52.93,33.33 IC1.31 | v52.73,57.4 52.73,56.9 IC2.31 | v52.73,32.72 53.03,33.02 53.14,33.02 53.19,33.07 | v87.68,28.45 85.34,26.11 v64.92,26.11
E16  (via drill 0.25)
  Top 0.203: v122.63,41.05 v122.63,29.16 | v87.07,41.05 87.27,40.84 87.27,37.9 87.07,37.69 v87.07,18.9 87.07,18.29 85.24,16.46 v72.24,16.46 | v64.41,17.68 v65.63,16.46 65.63,7.52 J1.26 | v53.34,43.28 54.15,42.47 v54.15,18.59
  Bottom 0.203: v122.63,29.16 122.63,20.62 IC5.2 | IC6.2 122.63,41.55 v122.63,41.05 122.43,40.95 120.8,39.32 90.12,39.32 87.88,41.55 IC4.2 87.58,41.55 v87.07,41.05 | v87.07,18.9 87.38,18.9 87.38,19.3 IC3.2 | 53.9,18.34 54.56,17.68 v64.41,17.68 | 53.9,18.34 52.93,19.3 IC1.2 | v53.34,43.28 52.93,42.88 IC2.2 | 53.9,18.34 v54.15,18.59 | v65.63,16.46 v72.24,16.46
E17  (via drill 0.25)
  Top 0.203: v123.85,41.05 v123.85,29.16 123.75,28.96 119.08,24.28 119.08,22.66 113.39,16.97 89.81,16.97 | v89.71,40.95 v89.71,20.83 89.81,20.62 89.81,16.97 | v64.82,18.29 68.17,14.94 v68.17,13.82 68.17,7.52 J1.27 | v54.25,43.48 54.66,43.08 54.66,20.52 v54.76,20.42 | 89.81,16.97 89.71,16.87 v89.71,16.46
  Bottom 0.203: v123.85,29.16 123.85,20.62 IC5.1 | v123.85,41.05 123.85,41.55 IC6.1 | v89.71,20.83 89.31,20.83 89.1,20.62 IC3.1 | v89.71,40.95 89.1,41.55 IC4.1 | v64.82,18.29 55.27,18.29 54.25,19.3 IC1.1 54.25,20.42 v54.76,20.42 | v54.25,43.48 54.25,42.88 IC2.1 | v89.71,16.46 87.07,13.82 v68.17,13.82
E18  (via drill 0.25)
  Top 0.203: v52.02,32.82 v52.02,57.3 52.12,57.51 52.12,58.52 71.73,58.52 | 85.39,57.66 84.53,58.52 71.73,58.52 | 85.39,57.66 v85.65,57.4 85.75,57.61 85.75,58.01 87.88,58.01 88.29,57.61 88.29,57.4 v112.27,57.4 | v69.6,13.21 70.81,14.43 70.81,20.42 71.73,21.34 71.73,58.52 | v85.55,32.72 85.34,32.92 85.34,57.61 85.39,57.66
  Bottom 0.203: IC5.30 121.01,33.33 119.28,31.6 86.56,31.6 86.56,33.33 IC3.30 86.16,33.33 v85.55,32.72 | v52.02,32.82 51.71,32.82 51.71,33.33 IC1.30 | v52.02,57.3 51.61,56.9 IC2.30 | v85.65,57.4 86.16,56.9 IC4.30 | v112.27,57.4 120.5,57.4 121.01,56.9 IC6.30 | v69.6,13.21 69.6,7.52 J1.34
E19  (via drill 0.25)
  Top 0.203: v17.78,19 11.79,24.99 11.79,39.52 12.39,40.13 IC7.4
  Bottom 0.203: v17.78,19 24.49,12.29 60.86,12.29 65.63,7.52 J1.35
E20  (via drill 0.25)
  Top 0.203: v56.08,36.47 57.61,34.95 57.61,13.01 v61.37,9.25
  Bottom 0.203: v56.08,36.47 15.95,36.47 14.53,37.9 IC7.5 | v61.37,9.25 63.09,7.52 J1.36
E21  (via drill 0.25)
  Top 0.203: v50.19,24.28 53.54,20.93 v53.54,11.68
  Bottom 0.203: v50.19,24.28 32.92,24.28 28.35,28.85 20.62,28.85 14.33,35.15 IC7.6 | v53.54,11.68 57.3,7.92 60.15,7.92 60.55,7.52 J1.37
ECLK  (via drill 0.25)
  Top 0.203: IC7.1 13.31,47.75 13.31,46.23 IC7.2 12.39,45.21 11.38,44.2 11.38,13.51 v15.95,8.94
  Bottom 0.203: v15.95,8.94 17.37,7.52 J1.54
GND  (via drill 0.3)
  Top 0.61: J1.1 3.25,7.52 3.25,13.41 C7.2 3.45,14.53 10.77,21.84 v10.77,23.27 | IC7.10 13.31,25.91 13.31,27.43 IC7.9 13.31,28.45 13.31,29.97 IC7.8 14.22,30.99 17.78,34.54 v17.78,43.38 | 99.67,36.68 v104.04,41.05 v104.04,45.11 v96.52,52.63 | 99.67,36.68 v96.11,33.12 | 99.67,36.68 v105.97,30.38 105.77,30.18 105.77,22.66 v103.94,20.83 | J1.30 75.79,3.86 74.68,3.86 J1.29 73.25,3.86 72.14,3.86 J1.28 71.42,7.52 v71.42,17.68 | v60.76,39.93 59.44,38.61 | 59.44,38.61 58.22,37.39 v58.22,33.12 58.42,32.92 58.42,26.72 v63.7,21.44 | v58.22,52.63 59.23,51.61 59.23,38.81 59.44,38.61
  Bottom 0.61: IC1.16 34.65,20.62 26.72,20.62 22.15,25.2 IC7.11 IC7.10 12.39,24.89 v10.77,23.27 | v96.11,33.12 92.66,33.12 92.56,33.02 C3.1 | v104.04,41.05 104.55,41.55 IC6.16 | v105.97,30.38 126.59,30.38 C5.1 | v104.04,45.11 119.08,45.11 126.59,52.63 C6.1 | v103.94,20.83 104.34,20.83 104.55,20.62 IC5.16 | 18.69,44.3 18.69,51.92 C8.1 17.68,52.63 3.15,52.63 3.15,59.23 5.28,61.37 9.86,61.37 9.86,60.76 R2.1 | 18.69,44.3 32.61,44.3 34.24,42.67 34.65,42.67 IC2.16 35.15,41.55 35.15,40.74 61.16,40.74 61.37,40.54 | v71.42,17.68 70.1,17.68 70.1,19.3 IC3.16 69.6,20.62 68.78,21.44 v63.7,21.44 | v58.22,33.12 57.71,33.12 57.61,33.02 C1.1 | 61.37,40.54 62.38,41.55 69.6,41.55 IC4.16 | 61.37,40.54 v60.76,39.93 | C2.1 57.61,52.63 v58.22,52.63 58.42,52.83 91.64,52.83 C4.1 92.56,52.63 v96.52,52.63 | v17.78,43.38 18.69,44.3
  other vias: 1.59,61.91 138.11,61.91 138.11,1.59 84.14,1.59 138.11,31.75 76.2,61.91 1.59,11.11 26.99,25.4 26.99,15.88 14.29,17.46 23.81,49.21 26.99,42.86 31.75,41.27 30.16,33.34 63.5,47.62 63.5,56.36 98.42,27.78 127,23.81
  pour Bottom: 0,63.5 139.7,63.5 139.7,0 0,0
  pour Top: 0,63.5 139.7,63.5 139.7,0 82.55,0 82.55,7.94 0,7.94
N$2
  Bottom 0.203: R2.2 8.13,59.84 7.32,59.03 PWR.K
R//W  (via drill 0.25)
  Top 0.203: v19.41,10.57 v19.41,37.49
  Bottom 0.203: v19.41,37.49 14.22,42.67 IC7.3 | v19.41,10.57 22.45,7.52 J1.52
VCC  (via drill 0.3)
  Top 0.61: 17.37,8.13 11.89,8.13 6.3,13.72 C7.1 | 17.37,8.13 17.37,7.52 J1.7 | v124.66,55.37 v124.66,35.26 124.66,27.33 112.98,15.65 85.75,15.65 85.55,15.85 | v55.78,54.97 55.47,55.27 | 55.47,55.27 v54.86,55.88 | v89.71,56.08 89.92,55.88 v89.92,54.76 90.53,54.15 90.53,42.67 | v55.27,34.85 55.27,55.07 55.47,55.27 | 90.53,42.67 v90.53,34.65 | 85.55,15.85 88.9,19.2 88.9,41.25 90.32,42.67 90.53,42.67 | 85.55,15.85 v80.16,10.46 | 17.37,8.13 18.59,9.35 18.59,46.33 20.02,47.75 IC7.20
  Bottom 0.61: C8.2 20.02,51.92 20.02,48.77 IC7.20 | PWR.A 4.88,58.52 9.96,53.44 19,53.44 19.61,52.83 C8.2 | C5.2 126.59,33.12 126.39,33.33 124.05,33.33 IC5.32 124.05,34.65 v124.66,35.26 | 124.66,55.58 124.05,55.58 IC6.32 | 124.66,55.58 126.39,55.58 126.59,55.37 C6.2 | v124.66,55.37 124.66,55.58 | 90.53,34.24 89.1,34.24 IC3.32 | 90.53,34.24 91.64,34.24 C3.2 | 55.27,34.24 54.25,34.24 IC1.32 | 55.27,34.24 56.69,34.24 C1.2 | 89.92,54.56 91.64,54.56 C4.2 | 89.92,54.56 57.61,54.56 C2.2 | v54.86,55.88 54.25,55.88 IC2.32 | v55.78,54.97 56.69,54.97 C2.2 | v89.71,56.08 89.1,56.08 IC4.32 | 89.92,54.56 v89.92,54.76 | v55.27,34.85 55.27,34.24 | v90.53,34.65 90.53,34.24 | v80.16,10.46 77.22,10.46 77.22,7.52 J1.31 | C8.2 20.42,52.43 39.12,52.43 41.05,54.36 56.69,54.36 C2.2
XMEM
  Bottom 0.203: IC7.7 12.39,32.51 10.16,30.28 10.16,14.43 21.74,14.43 24.89,11.28 47.45,11.28 47.85,10.87 47.85,7.52 J1.42

### Text on the board
tPlace: Pugputer 6309 - 3MB EXP. RAM